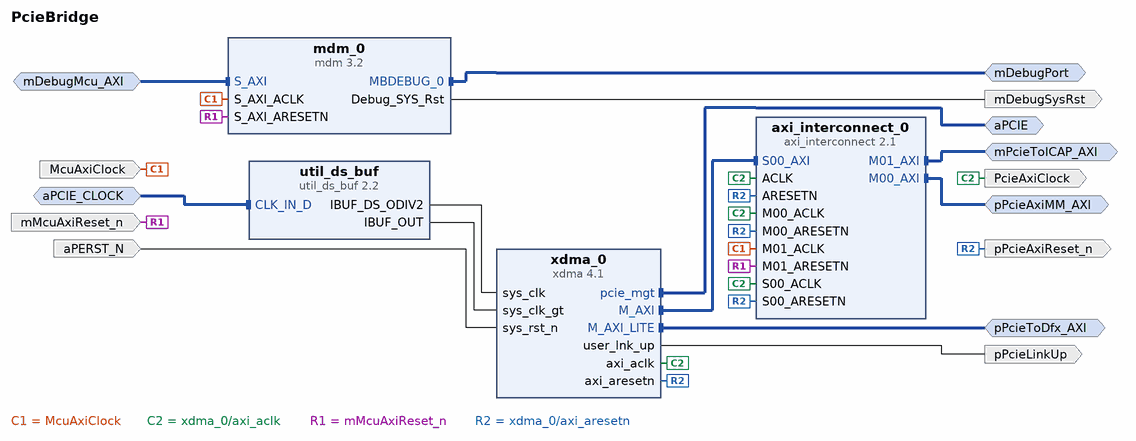
[diagram p0: block diagram of the top level]
# Vivado block design PcieBridge, xcau25p-ffvb676-2-e, Vivado 2024.1
create_bd_design PcieBridge

create_bd_intf_port -mode Master -vlnv xilinx.com:interface:pcie_7x_mgt_rtl:1.0 aPCIE
create_bd_intf_port -mode Master -vlnv xilinx.com:interface:aximm_rtl:1.0 pPcieToDfx_AXI
set_property -dict [list \
  CONFIG.ADDR_WIDTH 32 \
  CONFIG.DATA_WIDTH 32 \
  CONFIG.HAS_BURST 0 \
  CONFIG.HAS_CACHE 0 \
  CONFIG.HAS_LOCK 0 \
  CONFIG.HAS_QOS 0 \
  CONFIG.HAS_REGION 0 \
  CONFIG.PROTOCOL AXI4LITE \
] [get_bd_intf_ports pPcieToDfx_AXI]
create_bd_intf_port -mode Slave -vlnv xilinx.com:interface:aximm_rtl:1.0 mDebugMcu_AXI
set_property -dict [list \
  CONFIG.ADDR_WIDTH 16 \
  CONFIG.ARUSER_WIDTH 0 \
  CONFIG.AWUSER_WIDTH 0 \
  CONFIG.BUSER_WIDTH 0 \
  CONFIG.DATA_WIDTH 32 \
  CONFIG.HAS_BRESP 1 \
  CONFIG.HAS_BURST 0 \
  CONFIG.HAS_CACHE 0 \
  CONFIG.HAS_LOCK 0 \
  CONFIG.HAS_PROT 0 \
  CONFIG.HAS_QOS 0 \
  CONFIG.HAS_REGION 0 \
  CONFIG.HAS_RRESP 1 \
  CONFIG.HAS_WSTRB 1 \
  CONFIG.ID_WIDTH 0 \
  CONFIG.MAX_BURST_LENGTH 1 \
  CONFIG.NUM_READ_OUTSTANDING 1 \
  CONFIG.NUM_READ_THREADS 1 \
  CONFIG.NUM_WRITE_OUTSTANDING 1 \
  CONFIG.NUM_WRITE_THREADS 1 \
  CONFIG.PROTOCOL AXI4LITE \
  CONFIG.READ_WRITE_MODE READ_WRITE \
  CONFIG.RUSER_BITS_PER_BYTE 0 \
  CONFIG.RUSER_WIDTH 0 \
  CONFIG.SUPPORTS_NARROW_BURST 0 \
  CONFIG.WUSER_BITS_PER_BYTE 0 \
  CONFIG.WUSER_WIDTH 0 \
] [get_bd_intf_ports mDebugMcu_AXI]
create_bd_intf_port -mode Master -vlnv xilinx.com:interface:mbdebug_rtl:3.0 mDebugPort
create_bd_intf_port -mode Master -vlnv xilinx.com:interface:aximm_rtl:1.0 pPcieAxiMM_AXI
set_property -dict [list \
  CONFIG.ADDR_WIDTH 64 \
  CONFIG.DATA_WIDTH 128 \
  CONFIG.HAS_BURST 0 \
  CONFIG.HAS_QOS 0 \
  CONFIG.HAS_REGION 0 \
  CONFIG.NUM_READ_OUTSTANDING 32 \
  CONFIG.NUM_WRITE_OUTSTANDING 16 \
  CONFIG.PROTOCOL AXI4 \
] [get_bd_intf_ports pPcieAxiMM_AXI]
create_bd_intf_port -mode Slave -vlnv xilinx.com:interface:diff_clock_rtl:1.0 aPCIE_CLOCK
create_bd_intf_port -mode Master -vlnv xilinx.com:interface:aximm_rtl:1.0 mPcieToICAP_AXI
set_property -dict [list \
  CONFIG.ADDR_WIDTH 32 \
  CONFIG.DATA_WIDTH 32 \
  CONFIG.FREQ_HZ 100000000 \
  CONFIG.NUM_READ_OUTSTANDING 2 \
  CONFIG.NUM_WRITE_OUTSTANDING 2 \
  CONFIG.PROTOCOL AXI4 \
] [get_bd_intf_ports mPcieToICAP_AXI]
create_bd_port -dir I -type rst aPERST_N
set_property -dict {CONFIG.POLARITY ACTIVE_LOW} [get_bd_ports aPERST_N]
create_bd_port -dir O pPcieLinkUp
create_bd_port -dir I -type clk McuAxiClock
set_property -dict [list \
  CONFIG.ASSOCIATED_BUSIF mDebugMcu_AXI:mPcieToICAP_AXI \
  CONFIG.ASSOCIATED_RESET mMcuAxiReset_n \
  CONFIG.FREQ_HZ 100000000 \
] [get_bd_ports McuAxiClock]
create_bd_port -dir I -type rst mMcuAxiReset_n
create_bd_port -dir O -type rst mDebugSysRst
create_bd_port -dir O -type clk PcieAxiClock
set_property -dict [list \
  CONFIG.ASSOCIATED_BUSIF pPcieToDfx_AXI:pPcieAxiMM_AXI \
  CONFIG.ASSOCIATED_RESET pPcieAxiReset_n \
] [get_bd_ports PcieAxiClock]
create_bd_port -dir O -type rst pPcieAxiReset_n

create_bd_cell -type ip -vlnv xilinx.com:ip:xdma:4.1 xdma_0
set_property -dict [list \
  CONFIG.PCIE_BOARD_INTERFACE Custom \
  CONFIG.PF0_DEVICE_ID_mqdma 9034 \
  CONFIG.PF0_SRIOV_VF_DEVICE_ID A034 \
  CONFIG.PF2_DEVICE_ID_mqdma 9234 \
  CONFIG.PF3_DEVICE_ID_mqdma 9334 \
  CONFIG.SYS_RST_N_BOARD_INTERFACE Custom \
  CONFIG.axi_data_width 128_bit \
  CONFIG.axil_master_64bit_en false \
  CONFIG.axilite_master_en true \
  CONFIG.axisten_freq 250 \
  CONFIG.disable_gt_loc true \
  CONFIG.mode_selection Advanced \
  CONFIG.pf0_device_id 9034 \
  CONFIG.pl_link_cap_max_link_speed 8.0_GT/s \
  CONFIG.pl_link_cap_max_link_width X4 \
  CONFIG.plltype QPLL1 \
  CONFIG.ref_clk_freq 100_MHz \
  CONFIG.xdma_axi_intf_mm AXI_Memory_Mapped \
  CONFIG.xdma_axilite_slave false \
  CONFIG.xlnx_ref_board XEM8320-AU25P \
] [get_bd_cells xdma_0]
create_bd_cell -type ip -vlnv xilinx.com:ip:mdm:3.2 mdm_0
set_property -dict {CONFIG.C_TRACE_OUTPUT 0 CONFIG.C_USE_UART 1} [get_bd_cells mdm_0]
create_bd_cell -type ip -vlnv xilinx.com:ip:util_ds_buf:2.2 util_ds_buf
set_property -dict [list \
  CONFIG.C_BUF_TYPE IBUFDSGTE \
  CONFIG.DIFF_CLK_IN_BOARD_INTERFACE Custom \
  CONFIG.USE_BOARD_FLOW true \
] [get_bd_cells util_ds_buf]
create_bd_cell -type ip -vlnv xilinx.com:ip:axi_interconnect:2.1 axi_interconnect_0
set_property -dict {CONFIG.ENABLE_ADVANCED_OPTIONS 1 CONFIG.NUM_MI 2} [get_bd_cells axi_interconnect_0]

# ---- connections ----

connect_bd_intf_net [get_bd_intf_pins util_ds_buf/CLK_IN_D] [get_bd_intf_ports aPCIE_CLOCK]
connect_bd_intf_net [get_bd_intf_ports pPcieAxiMM_AXI] [get_bd_intf_pins axi_interconnect_0/M00_AXI]
connect_bd_intf_net [get_bd_intf_pins axi_interconnect_0/M01_AXI] [get_bd_intf_ports mPcieToICAP_AXI]
connect_bd_intf_net [get_bd_intf_pins mdm_0/S_AXI] [get_bd_intf_ports mDebugMcu_AXI]
connect_bd_intf_net [get_bd_intf_pins mdm_0/MBDEBUG_0] [get_bd_intf_ports mDebugPort]
connect_bd_intf_net [get_bd_intf_pins xdma_0/M_AXI] [get_bd_intf_pins axi_interconnect_0/S00_AXI]
connect_bd_intf_net [get_bd_intf_pins xdma_0/M_AXI_LITE] [get_bd_intf_ports pPcieToDfx_AXI]
connect_bd_intf_net [get_bd_intf_ports aPCIE] [get_bd_intf_pins xdma_0/pcie_mgt]
connect_bd_net [get_bd_ports McuAxiClock] [get_bd_pins axi_interconnect_0/M01_ACLK] [get_bd_pins mdm_0/S_AXI_ACLK]
connect_bd_net -net PcieAxiClock [get_bd_pins xdma_0/axi_aclk] \
  [get_bd_pins axi_interconnect_0/ACLK] [get_bd_pins axi_interconnect_0/S00_ACLK] [get_bd_pins axi_interconnect_0/M00_ACLK] \
  [get_bd_ports PcieAxiClock]
connect_bd_net [get_bd_ports mMcuAxiReset_n] [get_bd_pins mdm_0/S_AXI_ARESETN] [get_bd_pins axi_interconnect_0/M01_ARESETN]
connect_bd_net [get_bd_pins mdm_0/Debug_SYS_Rst] [get_bd_ports mDebugSysRst]
connect_bd_net -net pPcieAxiReset_n [get_bd_pins xdma_0/axi_aresetn] \
  [get_bd_pins axi_interconnect_0/M00_ARESETN] [get_bd_pins axi_interconnect_0/S00_ARESETN] \
  [get_bd_pins axi_interconnect_0/ARESETN] [get_bd_ports pPcieAxiReset_n]
connect_bd_net -net pPcieLinkUp [get_bd_pins xdma_0/user_lnk_up] [get_bd_ports pPcieLinkUp]
connect_bd_net -net pPcieSysRst_n [get_bd_ports aPERST_N] [get_bd_pins xdma_0/sys_rst_n]
connect_bd_net [get_bd_pins util_ds_buf/IBUF_DS_ODIV2] [get_bd_pins xdma_0/sys_clk]
connect_bd_net [get_bd_pins util_ds_buf/IBUF_OUT] [get_bd_pins xdma_0/sys_clk_gt]

# ---- address map ----
assign_bd_address -offset 0x0000 -range 4K -target_address_space [get_bd_addr_spaces mDebugMcu_AXI] [get_bd_addr_segs mdm_0/S_AXI/Reg]
assign_bd_address -offset 0x0000000044A00000 -range 64K -target_address_space [get_bd_addr_spaces xdma_0/M_AXI] [get_bd_addr_segs pPcieAxiMM_AXI/Reg]
assign_bd_address -offset 0x0000000044A10000 -range 64K -target_address_space [get_bd_addr_spaces xdma_0/M_AXI] [get_bd_addr_segs mPcieToICAP_AXI/Reg]
assign_bd_address -offset 0x44A00000 -range 64K -target_address_space [get_bd_addr_spaces xdma_0/M_AXI_LITE] [get_bd_addr_segs pPcieToDfx_AXI/Reg]

validate_bd_design
save_bd_design
